# Altium schematic sheet LTE.SchDoc
size A2
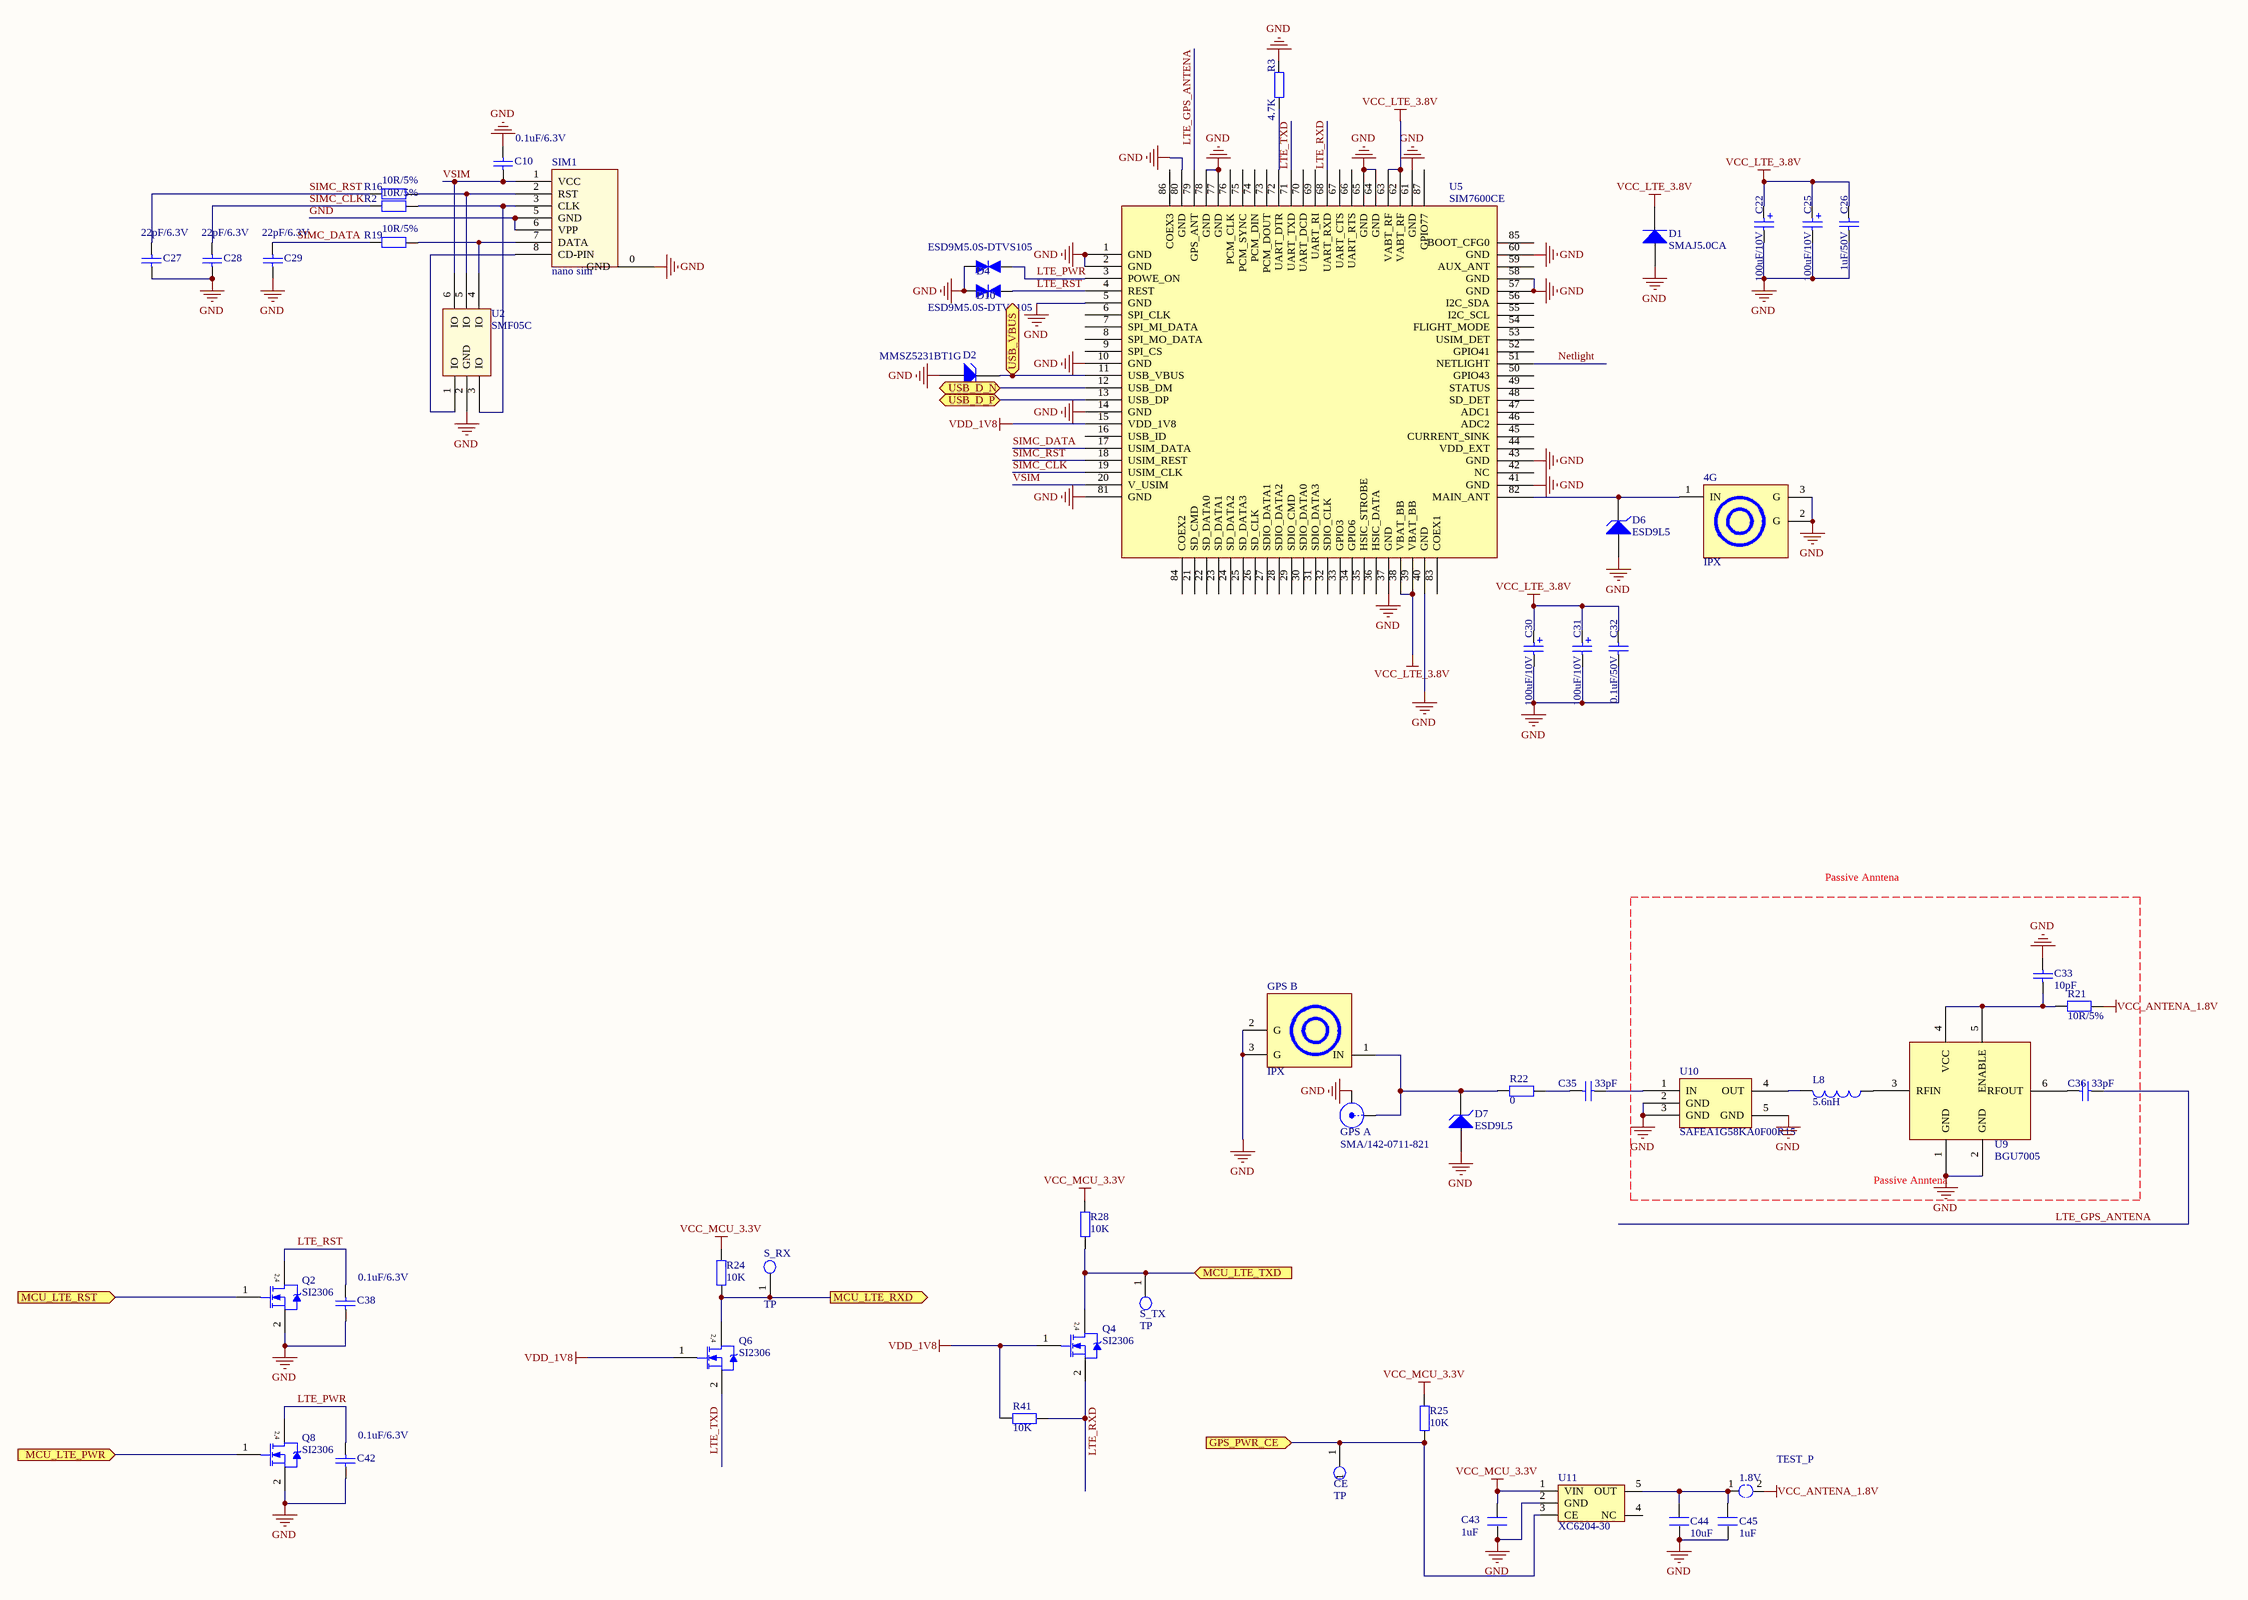
[diagram p0: LTE.SchDoc]

## Parts
1.8V  TEST_P  [TP_High PWR]
4G  IPX  [ECT8180001581]
C10  0.1uF/6.3V  [0603C]
C22  100uF/10V  [1210E]
C25  100uF/10V  [1210E]
C26  1uF/50V  [0603C]
C27  22pF/6.3V  [0603C]
C28  22pF/6.3V  [0603C]
C29  22pF/6.3V  [0603C]
C30  100uF/10V  [1210E]
C31  100uF/10V  [1210E]
C32  0.1uF/50V  [0603C]
C33  10pF  [0603C]
C35  33pF  [0603C]
C36  33pF  [0603C]
C38  0.1uF/6.3V  [0603C]
C42  0.1uF/6.3V  [0603C]
C43  1uF  [0603C]
C44  10uF  [0603C]
C45  1uF  [0402C]
CE  TP  [TPD]
D1  SMAJ5.0CA  [SMA]
D2  MMSZ5231BT1G  [SOD123]
D4  ESD9M5.0S-DTVS105  [SOD923]
D6  ESD9L5  [SOD923]
D7  ESD9L5  [SOD923]
D10  ESD9M5.0S-DTVS105  [SOD923]
GPS_A  SMA/142-0711-821  [SMA END LAUNCH JACK RECEPTACLE SHORT]
GPS_B  IPX  [ECT8180001581]
L8  5.6nH  [INDC1005AL]
Q2  SI2306  [SOT23-3]
Q4  SI2306  [SOT23-3]
Q6  SI2306  [SOT23-3]
Q8  SI2306  [SOT23-3]
R2  10R/5%  [0603R]
R3  4.7K  [0603R]
R16  10R/5%  [0603R]
R19  10R/5%  [0603R]
R21  10R/5%  [0603R]
R22  0  [0603R]
R24  10K  [0603R]
R25  10K  [0603R]
R28  10K  [0603R]
R41  10K  [0603R]
S_RX  TP  [TPD]
S_TX  TP  [TPD]
SIM1  nano sim  [Nano SIM]
U2  SMF05C  [SC70-6L]
U5  SIM7600CE  [SIM7600CE]
U9  BGU7005  [BGU7005]
U10  SAFEA1G58KA0F00R15  [SAFEA1G58KA0F00R15]
U11  XC6204-30  [SOT23-5(DBV)]

## Ports
GPS_PWR_CE (in), MCU_LTE_PWR (in), MCU_LTE_RST (in), MCU_LTE_RXD (out), MCU_LTE_TXD (in), USB_D_N, USB_D_P, USB_VBUS (bidir)

## Nets
GND: 4G.2(G) 4G.3(G) C10.1 C22.2 C25.2 C26.2 C27.2 C28.2 C29.2 C30.2 C31.2 C32.2 C33.2 C38.2 C42.2 C43.1 C44.1 C45.1 D1.1(A) D2.A D4.1(A) D6.A D7.A D10.1(A) GPS_A.2(GND) GPS_B.2(G) GPS_B.3(G) Q2.2(S) Q8.2(S) R3.1 SIM1.0(GND) SIM1.5(GND) SIM1.6(VPP) U2.2(GND) U5.1(GND) U5.2(GND) U5.5(GND) U5.10(GND) U5.14(GND) U5.37(GND) U5.40(GND) U5.41(GND) U5.43(GND) U5.57(GND) U5.58(GND) U5.60(GND) U5.61(GND) U5.64(GND) U5.65(GND) U5.77(GND) U5.78(GND) U5.80(GND) U5.81(GND) U9.1(GND) U9.2(GND) U10.2(GND) U10.3(GND) U10.5(GND) U11.2(GND)
VCC_ANTENA_1.8V: 1.8V.2 R21.2
VCC_LTE_3.8V: C22.1 C25.1 C26.1 C30.1 C31.1 C32.1 D1.2(K) U5.38(VBAT_BB) U5.39(VBAT_BB) U5.62(VABT_RF) U5.63(VABT_RF)
VCC_MCU_3.3V: C43.2 R24.1 R25.2 R28.2 U11.1(VIN)
VDD_1V8: Q4.1(G) Q6.1(G) R41.2 U5.15(VDD_1V8)
GPS_PWR_CE: CE.1 R25.1 U11.3(CE) ; port GPS_PWR_CE
LTE_GPS_ANTENA: C36.2 U5.79(GPS_ANT)
LTE_PWR: C42.1 D4.2(K) Q8.3(D) U5.3(POWE_ON)
LTE_RST: C38.1 D10.2(K) Q2.3(D) U5.4(REST)
LTE_RXD: Q4.2(S) R41.1 U5.68(UART_RXD)
LTE_TXD: Q6.2(S) U5.71(UART_TXD)
MCU_LTE_PWR: Q8.1(G) ; port MCU_LTE_PWR
MCU_LTE_RST: Q2.1(G) ; port MCU_LTE_RST
MCU_LTE_RXD: Q6.3(D) R24.2 S_RX.1 ; port MCU_LTE_RXD
MCU_LTE_TXD: Q4.3(D) R28.1 S_TX.1 ; port MCU_LTE_TXD
Netlight: U5.51(NETLIGHT)
SIMC_CLK: C28.1 R2.2 U5.19(USIM_CLK)
SIMC_DATA: C29.1 R19.2 U5.17(USIM_DATA)
SIMC_RST: C27.1 R16.2 U5.18(USIM_REST)
USB_D_N: U5.12(USB_DM) ; port USB_D_N
USB_D_P: U5.13(USB_DP) ; port USB_D_P
USB_VBUS: D2.K U5.11(USB_VBUS) ; port USB_VBUS
VSIM: C10.2 SIM1.1(VCC) U2.6(IO) U5.20(V_USIM)
Net1.8V_1: 1.8V.1 C44.2 C45.2 U11.5(OUT)
Net4G_1: 4G.1(IN) D6.K U5.82(MAIN_ANT)
NetC33_1: C33.1 R21.1 U9.4(VCC) U9.5(ENABLE)
NetC35_1: C35.1 R22.2
NetC35_2: C35.2 U10.1(IN)
NetC36_1: C36.1 U9.6(RFOUT)
NetD7_K: D7.K GPS_A.1(Signal) GPS_B.1(IN) R22.1
NetL8_1: L8.1 U9.3(RFIN)
NetL8_2: L8.2 U10.4(OUT)
NetR2_1: R2.1 SIM1.3(CLK) U2.3(IO)
NetR3_2: R3.2 U5.72(UART_DTR)
NetR16_1: R16.1 SIM1.2(RST) U2.5(IO)
NetR19_1: R19.1 SIM1.7(DATA) U2.4(IO)
NetSIM1_8: SIM1.8(CD-PIN) U2.1(IO)

Not connected (* = marked no-connect by the designer): U5 6(SPI_CLK) 7(SPI_MI_DATA) 8(SPI_MO_DATA) 9(SPI_CS) 16(USB_ID) 21(SD_CMD) 22(SD_DATA0) 23(SD_DATA1) 24(SD_DATA2) 25(SD_DATA3) 26(SD_CLK) 27(SDIO_DATA1) 28(SDIO_DATA2) 29(SDIO_CMD) 30(SDIO_DATA0) 31(SDIO_DATA3) 32(SDIO_CLK) 33(GPIO3) 34(GPIO6) 35(HSIC_STROBE) 36(HSIC_DATA) 42(NC) 44(VDD_EXT) 45(CURRENT_SINK) 46(ADC2) 47(ADC1) 48(SD_DET) 49(STATUS) 50(GPIO43) 52(GPIO41) 53(USIM_DET) 54(FLIGHT_MODE) 55(I2C_SCL) 56(I2C_SDA) 59(AUX_ANT) 66(UART_RTS) 67(UART_CTS) 69(UART_RI) 70(UART_DCD) 73(PCM_DOUT) 74(PCM_DIN) 75(PCM_SYNC) 76(PCM_CLK) 83(COEX1) 84(COEX2) 85(BOOT_CFG0) 86(COEX3) 87(GPIO77); U11 4(NC)

## Notes on the sheet
- Passive Anntena
- (near U9) Passive Anntena
- (in symbol BUK92150-55A) 2,4

## Library data of the parts
4G GPS_B = IPX: MCU; ComponentLink1Description: 供应商链接; ComponentLink1URL: http://www.szlcsc.com/product/details_9202.html; Package: LQFP-44_10x10x08P; Supplier: LC; SuppliersPartNumber: C8696
C10 C26-C29 C32 C33 C35 C36 C38 C42 = Cap: Capacitor; Value: 0.1uF/10V; Published: 8-Jun-2000; LatestRevisionDate: 17-Jul-2002; LatestRevisionNote: Re-released for DXP Platform.; PackageReference: RAD-0.3; Publisher: Altium Limited
C22 C25 C30 C31 = Cap Pol2: Polarized Capacitor (Axial); Value: 220uF/10V; Published: 8-Jun-2000; LatestRevisionDate: 17-Jul-2002; LatestRevisionNote: Re-released for DXP Platform.; PackageReference: POLAR0.8; Publisher: Altium Limited
C43-C45 = C
D1 = Diode: Default Diode; Published: 8-Jun-2000; LatestRevisionDate: 17-Jul-2002; LatestRevisionNote: Re-released for DXP Platform.; PackageVersion: Sep-1996; PackageReference: SMC; Publisher: Altium Limited; Code_JEDEC: DO-214-AB
D2 D6 D7 = D Zener: Zener Diode; Published: 8-Jun-2000; LatestRevisionDate: 17-Jul-2002; LatestRevisionNote: Re-released for DXP Platform.; PackageReference: DIODE-0.7; Publisher: Altium Limited
GPS_A = SMA: SMA Straight Connector; LatestRevisionDate: 05-oct-2007  -  Semtech; LatestRevisionNote: Re-released for DXP Platform.; Publisher: Altium Limited
L8 = Inductor: Code_IEC: 1005; Value: 10mH; Published: 8-Jun-2000; LatestRevisionDate: 29-May-2009; LatestRevisionNote: IPC-7351 Footprint Added.; PackageReference: 0402-A; Publisher: Altium Limited; PackageDescription: Chip Inductor; Code_JEITA: 0402
Q2 Q4 Q6 Q8 = BUK92150-55A: Published: 8-Jun-2000; LatestRevisionDate: 17-Jul-2002; LatestRevisionNote: Re-released for DXP Platform.; DatasheetVersion: 6-Oct-1997; PackageVersion: Aug-1998; PackageReference: TSOP-6; Publisher: Altium Limited; PackageDescription: SOT-457/SC-74; 6 Leads; Body 3.1 x 3 mm, inc. leads (LxW max); ComponentLink1Description: Manufacturer Link; ComponentLink1URL: http://www.vishay.com/; ComponentLink2Description: Datasheet; ComponentLink2URL: http://www.vishay.com/docs/70192/70192.pdf
R2 R3 R16 R19 R21 R22 R24 R25 R28 R41 = Res2: Resistor; Value: 10R; Published: 8-Jun-2000; LatestRevisionDate: 17-Jul-2002; LatestRevisionNote: Re-released for DXP Platform.; PackageReference: AXIAL-0.4; Publisher: Altium Limited
U11 = XC6204